# Altium project RFD_Interface_Board.PrjPcb
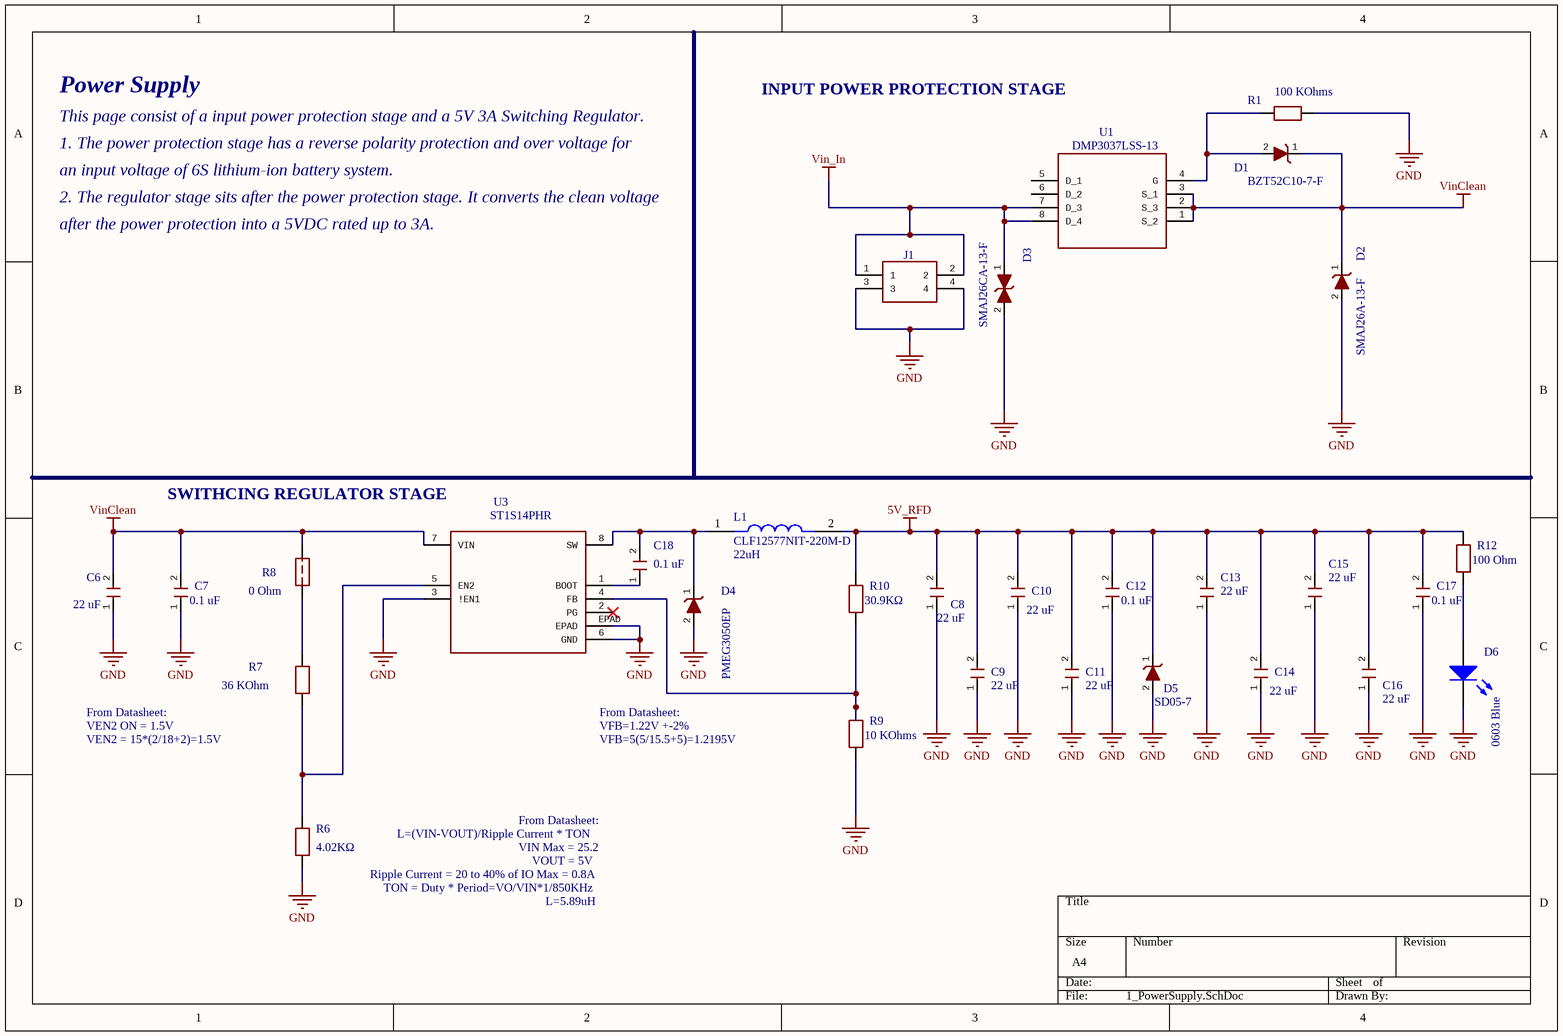
[diagram p0: 1_PowerSupply.SchDoc]
5 sheets, 60 parts. Net scope: flat (ports and power ports of the same name join across sheets).
Sheets:
  1_PowerSupply.SchDoc
  2_RFD900x.SchDoc
  3_Auxilaries.SchDoc
  3_UART_RS232_Conversion.SchDoc
  4_Auxilaries.SchDoc

## Sheet 1_PowerSupply.SchDoc
size A4

### Parts
C6  value 22 uF  [CAP_0805]  (hidden comment: C2012X5R1V226MT000E)
C7  value 0.1 uF  [CAP_0603]  (hidden comment: CL10B104KB8NNNC)
C8  value 22 uF  [CAP_0805]  (hidden comment: C2012X5R1V226MT000E)
C9  value 22 uF  [CAP_0805]  (hidden comment: C2012X5R1V226MT000E)
C10  value 22 uF  [CAP_0805]  (hidden comment: C2012X5R1V226MT000E)
C11  value 22 uF  [CAP_0805]  (hidden comment: C2012X5R1V226MT000E)
C12  value 0.1 uF  [CAP_0603]  (hidden comment: CL10B104KB8NNNC)
C13  value 22 uF  [CAP_0805]  (hidden comment: C2012X5R1V226MT000E)
C14  value 22 uF  [CAP_0805]  (hidden comment: C2012X5R1V226MT000E)
C15  value 22 uF  [CAP_0805]  (hidden comment: C2012X5R1V226MT000E)
C16  value 22 uF  [CAP_0805]  (hidden comment: C2012X5R1V226MT000E)
C17  value 0.1 uF  [CAP_0603]  (hidden comment: CL10B104KB8NNNC)
C18  value 0.1 uF  [CAP_0603]  (hidden comment: CL10B104KB8NNNC)
D1  BZT52C10-7-F  [DIODE_SOD-123]
D2  SMAJ26A-13-F  [DIODE_DO-214AC]
D3  SMAJ26CA-13-F  [DIODE_DO-214AC]
D4  PMEG3050EP  [DIODE_SOD-128]
D5  SD05-7  [DIODE_DO-214AC]
D6  0603 Blue  [0603_LED_S1]
J1  4 way r/a PCB header w/peg,Mini-Fit Jr Molex MINI-FIT JR. Series, Series Number 5569, 4.2mm Pitch 4 Way 2 Row Shrouded Right Angle PCB Header, Through Hole   Source:  Datasheet  [39-30-1040]  (value not drawn)
L1  CLF12577NIT-220M-D  value 22uH  [IND_TDK_CLF12577NIT]
R1  value 100 KOhms  [RES_0805]  (hidden comment: ERJP06J104V)
R6  value 4.02KΩ  [RES_0603]  (hidden comment: ERA3AEB4021V)
R7  value 36 KOhm  [RES_0603]  (hidden comment: ERJ3EKF3602V)
R8  value 0 Ohm  [RES_0603]  (hidden comment: ERJ3GEY0R00V)
R9  value 10 KOhms  [RES_0603]  (hidden comment: ERJ3GEYJ103V)
R10  value 30.9KΩ  [RES_0603]  (hidden comment: CRCW060330K9FKEA)
R12  value 100 Ohm  [RES_0603]  (hidden comment: ERJU3RD1000V)
U1  DMP3037LSS-13  [MOSFET_SOIC-8_150mil]
U3  ST1S14PHR  [REG_HSOP8]

### Nets
5V_RFD: C8.2 C9.2 C10.2 C11.2 C12.2 C13.2 C14.2 C15.2 C16.2 C17.2 D5.1 L1.2 R10.2 R12.2
GND: C6.1 C7.1 C8.1 C9.1 C10.1 C11.1 C12.1 C13.1 C14.1 C15.1 C16.1 C17.1 D2.2 D3.2 D4.2 D5.2 D6.K J1.3 J1.4 R1.2 R6.1 R9.1 U3.3(!EN1) U3.6(GND) U3.EPAD
Vin_In: D3.1 J1.1 J1.2 U1.7(D_3) U1.8(D_4)
VinClean: C6.2 C7.2 D1.1 D2.1 R8.2 U1.1(S_2) U1.2(S_3) U1.3(S_1) U3.7(VIN)
NetC18_1: C18.1 U3.1(BOOT)
NetC18_2: C18.2 D4.1 L1.1 U3.8(SW)
NetD1_2: D1.2 R1.1 U1.4(G)
NetD6_A: D6.A R12.1
NetR6_2: R6.2 R7.1 U3.5(EN2)
NetR7_2: R7.2 R8.1
NetR9_2: R9.2 R10.1 U3.4(FB)

Not connected (* = marked no-connect by the designer): U1 5(D_1) 6(D_2); U3 2(PG)*

### Notes on the sheet
- Power Supply
- INPUT POWER PROTECTION STAGE
- This page consist of a input power protection stage and a 5V 3A Switching Regulator.
- 1. The power protection stage has a reverse polarity protection and over voltage for
- an input voltage of 6S lithium-ion battery system.
- 2. The regulator stage sits after the power protection stage. It converts the clean voltage
- after the power protection into a 5VDC rated up to 3A.
- SWITHCING REGULATOR STAGE
- From Datasheet:
- VEN2 ON = 1.5V
- VEN2 = 15*(2/18+2)=1.5V
- VFB=1.22V +-2%
- VFB=5(5/15.5+5)=1.2195V
- L=(VIN-VOUT)/Ripple Current * TON
- VIN Max = 25.2
- Ripple Current = 20 to 40% of IO Max = 0.8A
- TON = Duty * Period=VO/VIN*1/850KHz
- VOUT = 5V
- L=5.89uH

### Library data of the parts
C6 C8-C11 C13-C16 = C2012X5R1V226MT000E: Cap Ceramic 22uF 50V 0805; Manufacturer_Part_Number: C2012X5R1V226MT000E; Link: https://www.digikey.ca/en/products/detail/tdk-corporation/C2012X5R1V226M125AC/3951664?s=N4IgTCBcDaIMJgAwEYwA0CsAlZA1MYAbALIAqiFAoiALoC%2BQA; Package: 0805; PartNumber: C2012X5R1V226MT000E; SupplierPartNumber: 445-14428-2-ND; SuppliersPartNumber: C338080
C7 C12 C17 C18 = CL10B104KB8NNNC: Cap Ceramic 0.1uF 50V 0603; Manufacturer_Name: Samsung; Link: https://www.digikey.ca/en/products/detail/samsung-electro-mechanics/CL10B104KB8NNNC/3886658?s=N4IgTCBcDaIMIBkCMAGAQqgLAaTQDgDki4QBdAXyA; Package: 0603; PartNumber: CL10B104KB8NNNC; SupplierPartNumber: 1276-1000-2-ND; SuppliersPartNumber: C1591
D1 = BZT52C10-7-F: Diode Zener 10V 370mW; Manufacturer_Name: Diodes Inc.; SymbolName_1: BZT52C10-7-F; LibraryName: BZT52C10-7-F; DeviceSetName: BZT52C10-7-F; Manufacturer_Part_Number: BZT52C10-7-F; Mouser_Part_Number: 621-BZT52C10-F; Mouser_Price-Stock: https://www.mouser.co.uk/ProductDetail/Diodes-Incorporated/BZT52C10-7-F?qs=%2F0USrAtie8G0fxvqWmtHrQ%3D%3D; Link: https://www.digikey.ca/en/products/detail/diodes-incorporated/BZT52C10-7-F/717726; Value: 10V 370mW; Package: SOD-123; PartNumber: BZT52C10-7-F; SupplierPartNumber: BZT52C10-FDITR-ND; SuppliersPartNumber: C155227
D2 = SMAJ26A-13-F: Diode TVS 26V; Mfr_Name: Diodes Inc; GateName_1: A; DeviceName: SMA_DIO; SymbolName_1: DIODE; LibraryName: 2022-09-06_21-11-13_Library; DeviceSetName: SMAJ26A-13-F; Copyright: Copyright (C) 2022 Ultra Librarian. All rights reserved.; Manufacturer_Part_Number: SMAJ26A-13-F; Digi-Key_Part_Number_1: SMAJ26A-FDICT-ND; Digi-Key_Part_Number_2: SMAJ26A-FDIDKR-ND; Digi-Key_Part_Number_3: SMAJ26A-FDITR-ND; Link: https://www.digikey.ca/en/products/detail/diodes-incorporated/SMAJ26A-13-F/806555?s=N4IgTCBcDaIMoFkCCApMA2JBaAjAZiwDEQBdAXyA; Package: DO-214AC; PartNumber: SMAJ26A-13-F; SupplierPartNumber: SMAJ26A-FDITR-ND; SuppliersPartNumber: C134975
D3 = SMAJ26CA-13-F: Diode TVS Bidirectional 26V; Mfr_Name: Diodes Inc; Manufacturer_Part_Number: SMAJ26A-13-F; Value: 26V; Link: https://www.digikey.ca/en/products/detail/diodes-incorporated/SMAJ26A-13-F/806555?s=N4IgTCBcDaIMoFkCCApMA2JBaAYgEQEkAVAJSwDk8QBdAXyA; Package: DO-214AC; PartNumber: SMAJ26CA-13-F; SupplierPartNumber: SMAJ26CA-FDITR-ND; SuppliersPartNumber: C134976
D4 = PMEG3050EP: Diode FastRecovery 30V SOD-128; Mfr_Name: Nexperia; Value: FastRecovery 30V; Link: https://www.digikey.ca/en/products/detail/nexperia-usa-inc/PMEG3050EP-115/2228695; Package: SOD-128; PartNumber: PMEG3050EP; SupplierPartNumber: 1727-5317-2-ND; SuppliersPartNumber: C134975
D5 = SD05-7: Diode TVS 5V; Mfr_Name: Diodes Inc; Value: TVS 5V; Link: https://www.digikey.ca/en/products/detail/diodes-incorporated/SD05-7/2052792; Package: SOD-323; PartNumber: SD05-7; SupplierPartNumber: SD05DITR-ND; SuppliersPartNumber: C460454
D6 = 0603 LED Blue: LED; ComponentLink1Description: 供应商链接; ComponentLink1URL: http://www.szlcsc.com/product/details_73150.html; Package: 0603; Supplier: LC; SuppliersPartNumber: C72041; Color: Blue
J1 = 39-30-1040: GateName_1: G$1; SymbolName_1: 39-30-1040; LibraryName: 39-30-1040; DeviceSetName: 39-30-1040; Manufacturer_Name: Molex; Manufacturer_Part_Number: 39-30-1040; Mouser_Part_Number: 538-39-30-1040; Mouser_Price-Stock: https://www.mouser.co.uk/ProductDetail/Molex/39-30-1040?qs=tRPrwvvr%2FugKtPXHFlZTbg%3D%3D; Height: mm
L1 = CLF12577NIT-220M-D: Ind 22uH Shielded Drum Core 4.5A; Manufacturer: TDK; PartNumber: CLF12577NIT-220M-D; Package: NON STANDARD-2 TDK; Link: https://www.digikey.ca/en/products/detail/tdk-corporation/CLF12577NIT-220M-D/6236873?s=N4IgTCBcDaIMIBkBiBGMBWA7JgcgSQBUBaMMABgFkiAREAXQF8g; SupplierPartNumber: 445-174735-2-ND; SuppliersPartNumber: C138319
R1 = ERJP06J104V: Res 100KOhms 1/2W 0805; Link: https://www.digikey.ca/en/products/detail/panasonic-electronic-components/ERJ-P06J104V/525199?s=N4IgTCBcDaIKICUBSAFADANiQRjQFgDUQBdAXyA; Package: 0805; PartNumber: ERJP06J104V; SupplierPartNumber: P100KADTR-ND; SuppliersPartNumber: C441960
R6 = ERA3AEB4021V: Res 4.02KOhm 1/10W 0603; Manufacturer_Name: Panasonic; PartNumber: ERJ3GEYJ200V; Link: https://www.digikey.ca/en/products/detail/panasonic-electronic-components/ERA-3AEB4021V/2026802?s=N4IgTCBcDaIKICUCCBmJcBCAWADGAjAGogC6AvkA; Package: 0603; SupplierPartNumber: P4.02KDBTR-ND; SuppliersPartNumber: C491130
R7 = ERJ3EKF3602V: Res 36KOhm 1/10W 0603; Manufacturer_Name: Panasonic; Link: https://www.digikey.ca/en/products/detail/panasonic-electronic-components/ERJ-3EKF3602V/1746389?s=N4IgTCBcDaIKICUBSBmOBpAYigbABjADUQBdAXyA; Package: 0603; PartNumber: ERJ3EKF3602V; SupplierPartNumber: P36.0KHTR-ND; SuppliersPartNumber: C403181
R8 = ERJ3GEY0R00V: Res 0Ohm 1/10W 0603; Link: https://www.digikey.ca/en/products/detail/panasonic-electronic-components/ERJ-3GEY0R00V/135656?s=N4IgTCBcDaIKICUBSBmA4nAmgBgd7AaiALoC%2BQA; Package: 0603; SupplierPartNumber: P0.0GTR-ND; SuppliersPartNumber: C122704; PartNumber: ERJ3GEY0R00V
R9 = ERJ3GEYJ103V: Res 10KOhms 1/10W 0603; Link: https://www.mouser.ca/ProductDetail/Panasonic/ERJ-3GEYJ103V?qs=66DK8nO8gJBWgc%252B0VNNxzg%3D%3D; Package: 0603; PartNumber: ERJ3GEYJ103V; SupplierPartNumber: 667-ERJ-3GEYJ103V; SuppliersPartNumber: C169849
R10 = CRCW060330K9FKEA: Res 30.9KOhm 1/10W 0603; Manufacturer_Name: Vishay Intertech; Link: https://www.digikey.ca/en/products/detail/vishay-dale/CRCW060330K9FKEAHP/2222269; Package: 0603; SupplierPartNumber: 541-30.9KSTR-ND; SuppliersPartNumber: C844354; PartNumber: CRCW060330K9FKEA
R12 = ERJU3RD1000V: Res 100Ohm 1/10W 0603; Manufacturer_Name: Panasonic; Link: https://www.digikey.ca/en/products/detail/panasonic-electronic-components/ERJ-U3RD1000V/12549636?s=N4IgTCBcDaIKICUBSBVAzAgIgRgAz4DUQBdAXyA; Package: 0603; SupplierPartNumber: 10-ERJ-U3RD1000VTR-ND; SuppliersPartNumber: C491168; PartNumber: ERJU3RD1000V
U1 = DMP3037LSS-13: P-Channel 30V 5.8A; PartNumber: Diodes Inc; SupplierPartNumber: DMP3037LSS-13DITR-ND; Link: https://www.digikey.ca/en/products/detail/diodes-incorporated/DMP3037LSS-13/4869019?s=N4IgTCBcDaICIFkAKBmADCg7AGQMq4FoBGFEAXQF8g; SuppliersPartNumber: C150501; Value: 30V 5.8A; Package: SOIC-8_150mil
U3 = ST1S14PHR: Switching Step-down; Mfr_Name: STMicroelectronics; DeviceSetName: ST1S14PHR; Manufacturer_Part_Number: ST1S14PHR; Value: Switching Step-down; Link: https://www.digikey.ca/en/products/detail/stmicroelectronics/ST1S14PHR/2469146?s=N4IgTCBcDaIMoBUCMckBYAKAJASiAugL5A; Package: HSOP-8; PartNumber: ST1S14PHR; SupplierPartNumber: 497-10816-2-ND; SuppliersPartNumber: C84130

## Sheet 2_RFD900x.SchDoc
size A4
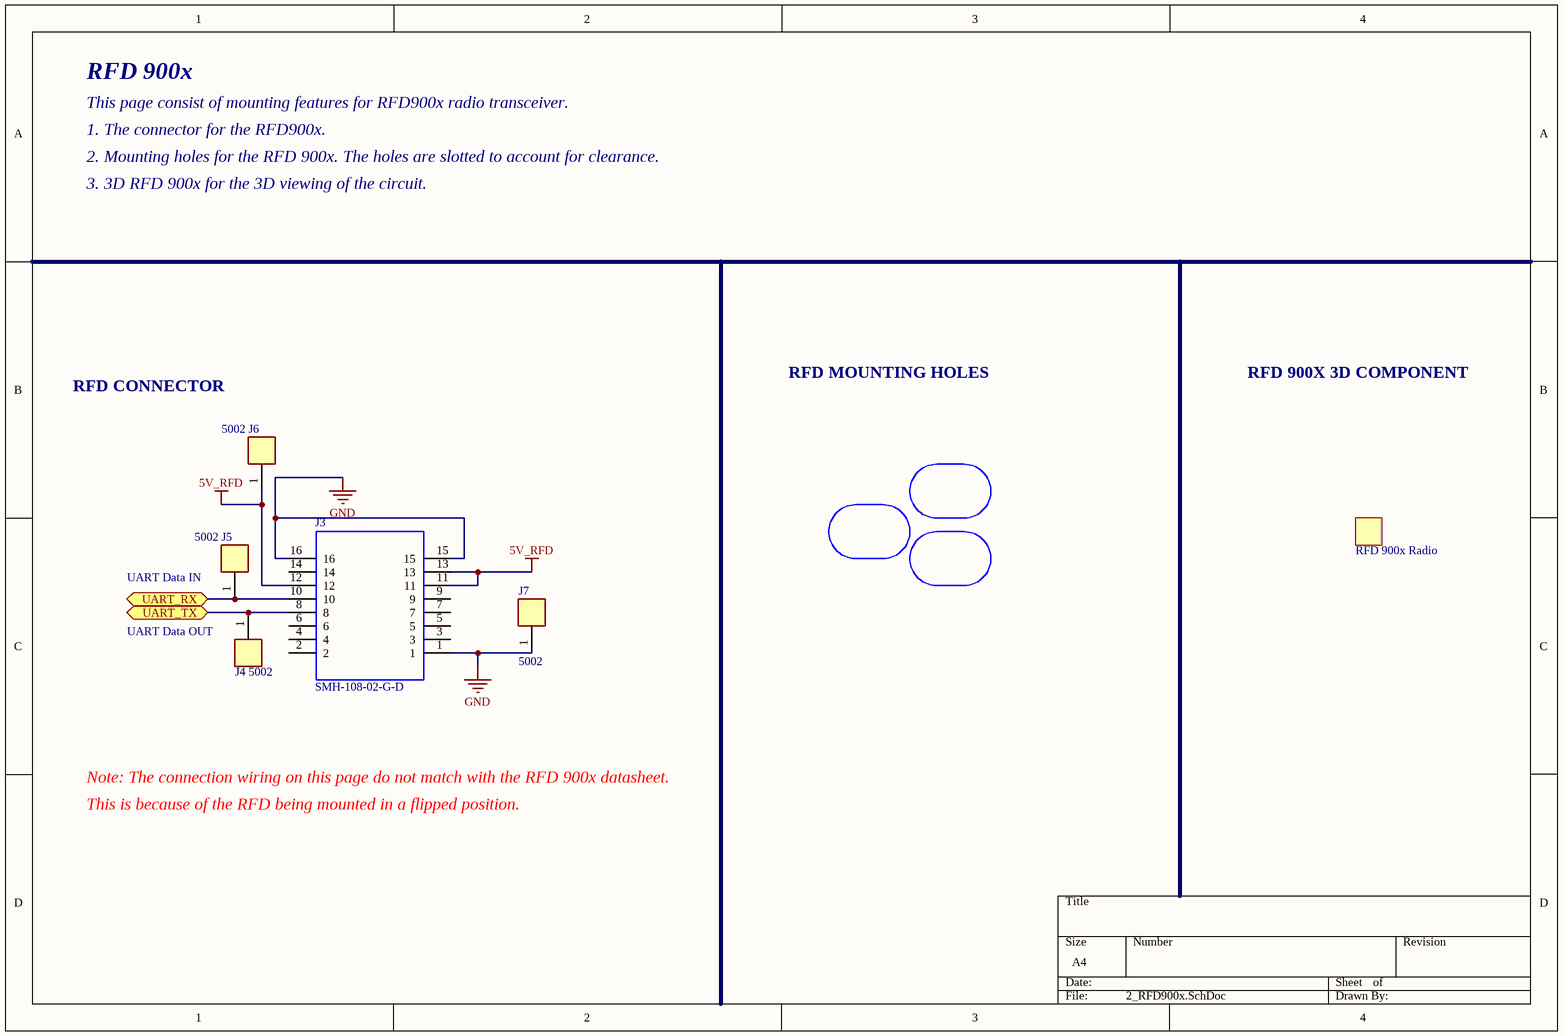
[diagram p1: 2_RFD900x.SchDoc]

### Parts
*  RFD 900x Radio  [RFD900X]  (no BOM)
H5  M3 not plated slotted  [M3 not plated - slotted]  (value not drawn)
H6  M3 not plated slotted  [M3 not plated - slotted]  (value not drawn)
H7  M3 not plated slotted  [M3 not plated - slotted]  (value not drawn)
J3  SMH-108-02-G-D  [SAMTEC_SMH-108-02-G-D]
J4  5002  [KEYSTONE_5002]
J5  5002  [KEYSTONE_5002]
J6  5002  [KEYSTONE_5002]
J7  5002  [KEYSTONE_5002]

### Ports
UART_RX, UART_TX

### Nets
5V_RFD: J3.11 J3.12 J3.13 J6.1
GND: J3.1 J3.15 J3.16 J7.1
NetJ3_8: J3.8 J4.1 ; port UART_TX
NetJ3_10: J3.10 J5.1 ; port UART_RX

Not connected (* = marked no-connect by the designer): J3 2 3 4 5 6 7 9 14

### Notes on the sheet
- RFD 900x
- This page consist of mounting features for RFD900x radio transceiver.
- 1. The connector for the RFD900x.
- 2. Mounting holes for the RFD 900x. The holes are slotted to account for clearance.
- 3. 3D RFD 900x for the 3D viewing of the circuit.
- RFD MOUNTING HOLES
- RFD 900X 3D COMPONENT
- RFD CONNECTOR
- (near J5) UART Data IN
- UART Data OUT
- Note: The connection wiring on this page do not match with the RFD 900x datasheet.
- This is because of the RFD being mounted in a flipped position.

### Library data of the parts
H5-H7 = M3 not plated slotted: M3 hole not plated slotted
J3 = SMH-108-02-G-D: SAMTEC 16POS 0.1"pitch; PartNumber: SAM11816-ND; Value: 0.1 inch pitch header; Package: *; Link: https://www.digikey.ca/en/products/detail/samtec-inc/SMH-108-02-G-D/6693456; SupplierPartNumber: SMH-108-02-G-D; SuppliersPartNumber: *
J4-J7 = 5002: Test Point Ring Keystone; Manufacturer: Keystone Electronics; Value: Test Point Keystone Electronics; Package: *; PartNumber: 5002; SupplierNumber: 36-5002-ND; SuppliersPartNumber: C238123; Link: https://www.digikey.ca/en/products/detail/keystone-electronics/5002/255328

## Sheet 3_Auxilaries.SchDoc
size A4
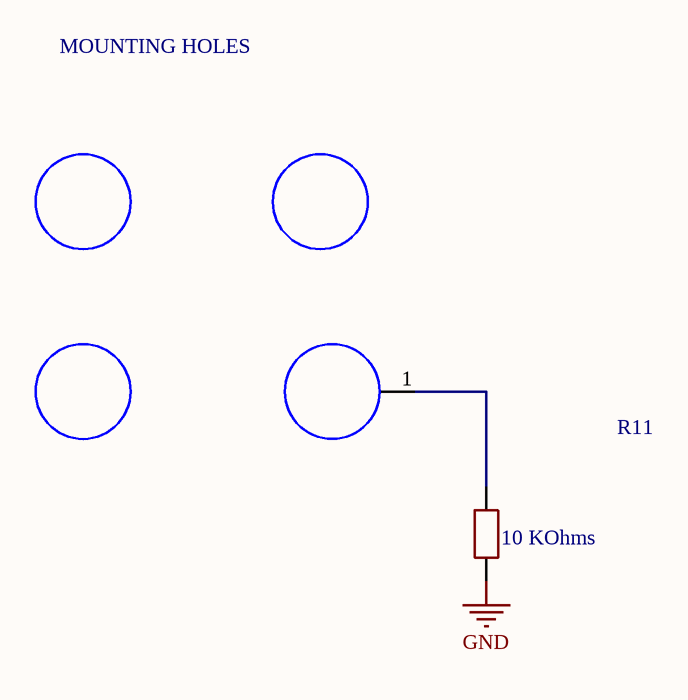
[diagram p2: 3_Auxilaries.SchDoc]

### Parts
(Parts that share a designator on the sheet are numbered #1, #2 ... from top to bottom, then left to right.)
H1#1  M3 not plated  [M3 not plated]  (value not drawn)
H2#1  M3 not plated  [M3 not plated]  (value not drawn)
H3#1  M3 not plated  [M3 not plated]  (value not drawn)
H4#1  M3 plated  [M3 plated]  (value not drawn)
R11#1  value 10 KOhms  [RES_0603]  (hidden comment: ERJ3GEYJ103V)

### Nets
GND: R11#1.2
NetH4#1_1: H4#1.1 R11#1.1

### Notes on the sheet
- MOUNTING HOLES

### Library data of the parts
H1#1 H2#1 H3#1 = M3 not plated: M3 hole not plated
H4#1 = M3 plated: M3 hole plated
R11#1 = ERJ3GEYJ103V: Res 10KOhms 1/10W 0603; Link: https://www.mouser.ca/ProductDetail/Panasonic/ERJ-3GEYJ103V?qs=66DK8nO8gJBWgc%252B0VNNxzg%3D%3D; Package: 0603; PartNumber: ERJ3GEYJ103V; SupplierPartNumber: 667-ERJ-3GEYJ103V; SuppliersPartNumber: C169849

## Sheet 3_UART_RS232_Conversion.SchDoc
size A4
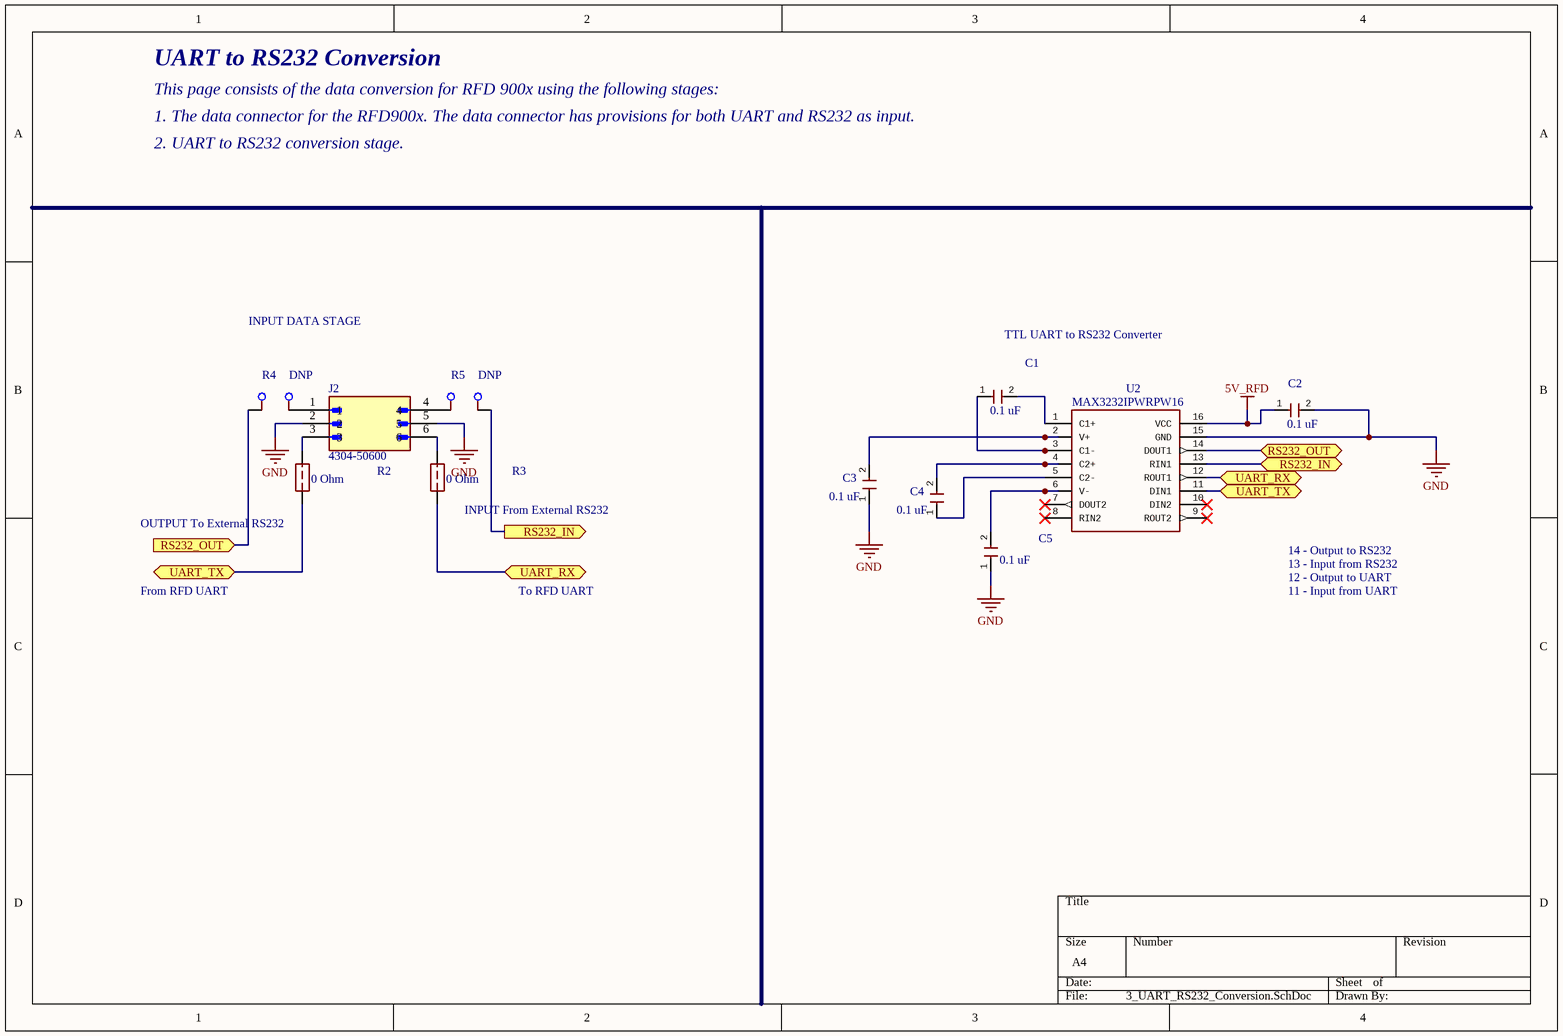
[diagram p3: 3_UART_RS232_Conversion.SchDoc]

### Parts
C1  value 0.1 uF  [CAP_0603]  (hidden comment: CL10B104KB8NNNC)
C2  value 0.1 uF  [CAP_0603]  (hidden comment: CL10B104KB8NNNC)
C3  value 0.1 uF  [CAP_0603]  (hidden comment: CL10B104KB8NNNC)
C4  value 0.1 uF  [CAP_0603]  (hidden comment: CL10B104KB8NNNC)
C5  value 0.1 uF  [CAP_0603]  (hidden comment: CL10B104KB8NNNC)
J2  4304-50600  [MOLEX_MICRO-6POS]
R2  value 0 Ohm  [RES_0603]  (hidden comment: ERJ3GEY0R00V)
R3  value 0 Ohm  [RES_0603]  (hidden comment: ERJ3GEY0R00V)
R4  value DNP  [RES_0603_DNP]  (hidden comment: 0603 Resistor DNP)
R5  value DNP  [RES_0603_DNP]  (hidden comment: 0603 Resistor DNP)
U2  MAX3232IPWRPW16  [INTERFACE_TSSOP-16]

### Ports
RS232_IN, RS232_IN (out), RS232_OUT, RS232_OUT (in), UART_RX, UART_TX

### Nets
5V_RFD: C2.1 U2.16(VCC)
GND: C2.2 C3.1 C5.1 J2.2 J2.5 U2.15(GND)
NetC1_1: C1.1 U2.3(C1-)
NetC1_2: C1.2 U2.1(C1+)
NetC3_2: C3.2 U2.2(V+)
NetC4_1: C4.1 U2.5(C2-)
NetC4_2: C4.2 U2.4(C2+)
NetC5_2: C5.2 U2.6(V-)
NetJ2_1: J2.1 R4.2
NetJ2_3: J2.3 R2.2
NetJ2_4: J2.4 R5.1
NetJ2_6: J2.6 R3.2
NetJ3_8: R2.1 U2.11(DIN1) ; port UART_TX
NetJ3_10: R3.1 U2.12(ROUT1) ; port UART_RX
NetR4_1: R4.1 U2.14(DOUT1) ; port RS232_OUT
NetR5_2: R5.2 U2.13(RIN1) ; port RS232_IN

Not connected (* = marked no-connect by the designer): U2 7(DOUT2)* 8(RIN2)* 9(ROUT2)* 10(DIN2)*

### Notes on the sheet
- UART to RS232 Conversion
- This page consists of the data conversion for RFD 900x using the following stages:
- 1. The data connector for the RFD900x. The data connector has provisions for both UART and RS232 as input.
- 2. UART to RS232 conversion stage.
- INPUT DATA STAGE
- TTL UART to RS232 Converter
- (near R3) INPUT From External RS232
- (near R2) OUTPUT To External RS232
- 13 - Input from RS232
- 14 - Output to RS232
- 12 - Output to UART
- From RFD UART
- To RFD UART
- 11 - Input from UART

### Library data of the parts
C1-C5 = CL10B104KB8NNNC: as C7 on sheet 1_PowerSupply; Link: https://www.digikey.ca/en/products/detail/samsung-electro-mechanics/CL10B104KB8NNNC/3886658?s=N4IgTCBcDaIMIBkCMAGAQqgLAaTQDgDki4QBdAXyA; Package: 0603; PartNumber: CL10B104KB8NNNC; SupplierPartNumber: 1276-1000-2-ND; SuppliersPartNumber: C1591
J2 = 43045-0600: Molex Microfit 6POS; PartNumber: 430450600; SupplerNumber: WM1815-ND; Package: None; Manufacturer: Molex; Value: *; Link: https://www.digikey.ca/en/products/detail/molex/0430450600/252528; SuppliersPartNumber: *
R2 R3 = ERJ3GEY0R00V: Res 0Ohm 1/10W 0603; Link: https://www.digikey.ca/en/products/detail/panasonic-electronic-components/ERJ-3GEY0R00V/135656?s=N4IgTCBcDaIKICUBSBmA4nAmgBgd7AaiALoC%2BQA; Package: 0603; SupplierPartNumber: P0.0GTR-ND; SuppliersPartNumber: C122704; PartNumber: ERJ3GEY0R00V
R4 R5 = RES_0603: 0603 RES Footprint; SuppliersPartNumber: *
U2 = MAX3232IPWRPW16: Transceiver 3.3~5V 250Kbps; Manufacturer: Texas Instruments; Value: 3V~5.5V transceiver; SupplierNumber: 296-13100-2-ND; PartNumber: MAX3232IPWR; SuppliersPartNumber: C113205; Link: https://jlcpcb.com/partdetail/TexasInstruments-MAX3232IPWR/C113205; Package: TSSOP-16

## Sheet 4_Auxilaries.SchDoc
size A4
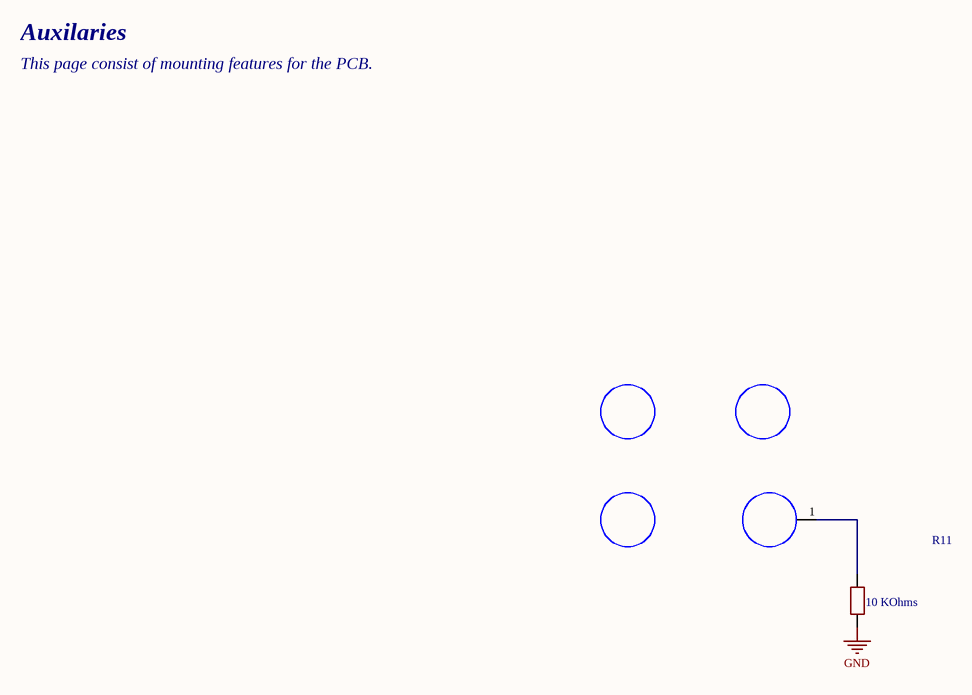
[diagram p4: 4_Auxilaries.SchDoc]

### Parts
(Parts that share a designator on the sheet are numbered #1, #2 ... from top to bottom, then left to right.)
H1#2  M3 not plated  [M3 not plated]  (value not drawn)
H2#2  M3 not plated  [M3 not plated]  (value not drawn)
H3#2  M3 not plated  [M3 not plated]  (value not drawn)
H4#2  M3 plated  [M3 plated]  (value not drawn)
R11#2  value 10 KOhms  [RES_0603]  (hidden comment: ERJ3GEYJ103V)

### Nets
GND: R11#2.2
NetH4#2_1: H4#2.1 R11#2.1

### Notes on the sheet
- Auxilaries
- This page consist of mounting features for the PCB.

### Library data of the parts
H1#2 H2#2 H3#2 = M3 not plated: M3 hole not plated
H4#2 = M3 plated: M3 hole plated
R11#2 = ERJ3GEYJ103V: Res 10KOhms 1/10W 0603; Link: https://www.mouser.ca/ProductDetail/Panasonic/ERJ-3GEYJ103V?qs=66DK8nO8gJBWgc%252B0VNNxzg%3D%3D; Package: 0603; PartNumber: ERJ3GEYJ103V; SupplierPartNumber: 667-ERJ-3GEYJ103V; SuppliersPartNumber: C169849

## Nets that join several sheets
5V_RFD: 1_PowerSupply (14 pins), 2_RFD900x (J3.11 J3.12 J3.13 J6.1), 3_UART_RS232_Conversion (C2.1 U2.16)
GND: 1_PowerSupply (25 pins), 2_RFD900x (J3.1 J3.15 J3.16 J7.1), 3_Auxilaries (R11#1.2), 3_UART_RS232_Conversion (6 pins), 4_Auxilaries (R11#2.2)
NetJ3_8: 2_RFD900x (J3.8 J4.1), 3_UART_RS232_Conversion (R2.1 U2.11)
NetJ3_10: 2_RFD900x (J3.10 J5.1), 3_UART_RS232_Conversion (R3.1 U2.12)